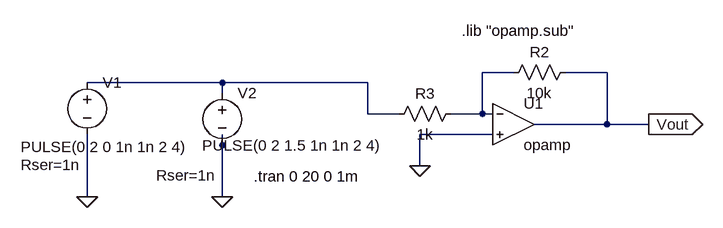
[diagram p0: schematic Draft3.asc]
Draft3.asc, the LTspice schematic file:
Version 4
SHEET 1 880 680
WIRE 48 -64 0 -64
WIRE 192 -64 128 -64
WIRE -400 -48 -608 -48
WIRE -176 -48 -400 -48
WIRE -400 -32 -400 -48
WIRE -176 0 -176 -48
WIRE -128 0 -176 0
WIRE 0 0 0 -64
WIRE 0 0 -48 0
WIRE 16 0 0 0
WIRE 192 16 192 -64
WIRE 192 16 80 16
WIRE 256 16 192 16
WIRE 16 32 -96 32
WIRE -400 48 -400 32
WIRE -96 80 -96 32
WIRE -608 128 -608 32
WIRE -400 128 -400 48
FLAG -96 80 0
FLAG 256 16 Vout
IOPIN 256 16 Out
FLAG -400 128 0
FLAG -608 128 0
SYMBOL OpAmps\\opamp 48 -48 R0
SYMATTR InstName U1
SYMBOL res 144 -80 R90
WINDOW 0 0 56 VBottom 2
WINDOW 3 32 56 VTop 2
SYMATTR InstName R2
SYMATTR Value 10k
SYMBOL voltage -608 -64 R0
WINDOW 3 -102 115 Left 2
WINDOW 123 -102 87 Left 2
WINDOW 39 -102 143 Left 2
SYMATTR Value PULSE(0 2 0 1n 1n 2 4)
SYMATTR SpiceLine Rser=1n
SYMATTR InstName V1
SYMBOL voltage -400 -48 R0
WINDOW 3 -31 97 Left 2
WINDOW 123 -102 87 Left 2
WINDOW 39 -102 143 Left 2
SYMATTR Value PULSE(0 2 1.5 1n 1n 2 4)
SYMATTR SpiceLine Rser=1n
SYMATTR InstName V2
SYMBOL res -144 16 R270
WINDOW 0 32 56 VTop 2
WINDOW 3 0 56 VBottom 2
SYMATTR InstName R3
SYMATTR Value 1k
TEXT -352 96 Left 2 !.tran 0 20 0 1m
TEXT -32 -128 Left 2 !.lib "opamp.sub"

The netlist it stands for:
* Draft3.asc
XU1 N001 0 Vout opamp Aol=100K GBW=10Meg  ; pins invin noninvin out
R2 Vout N001 10k
V1 N002 0 PULSE(0 2 0 1n 1n 2 4) Rser=1n
V2 N002 0 PULSE(0 2 1.5 1n 1n 2 4) Rser=1n
R3 N002 N001 1k
.tran 0 20 0 1m
.lib "opamp.sub"
.backanno
.end